# EAGLE design LCD (EAGLE 7.7.0)
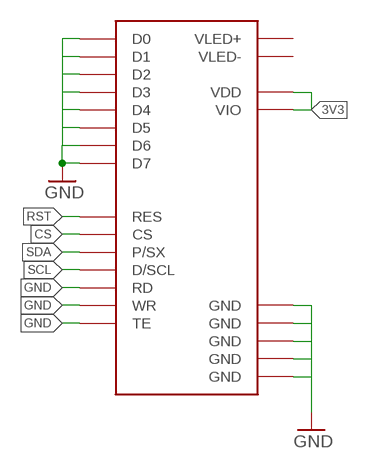
[diagram p0: schematic, sheet 1]

## Parts
U$1  NOKIA_LCD-CONN  [NOKIA3500]

## Nets
3V3: U$1.VDD U$1.VIO
CS: U$1.CS
GND: U$1.D0 U$1.D1 U$1.D2 U$1.D3 U$1.D4 U$1.D5 U$1.D6 U$1.D7 U$1.GND U$1.GND@1(GND) U$1.GND@3(GND) U$1.GND@4(GND) U$1.GND@5(GND) U$1.RD U$1.TE U$1.WR
RST: U$1.RES
SCL: U$1.D/CX_SCL(D/SCL)
SDA: U$1.P/S(P/SX)
Unconnected: U$1.VLED+ U$1.VLED-

## Library data of the parts
U$1 = nokia:NOKIA_LCD-CONN

## Board
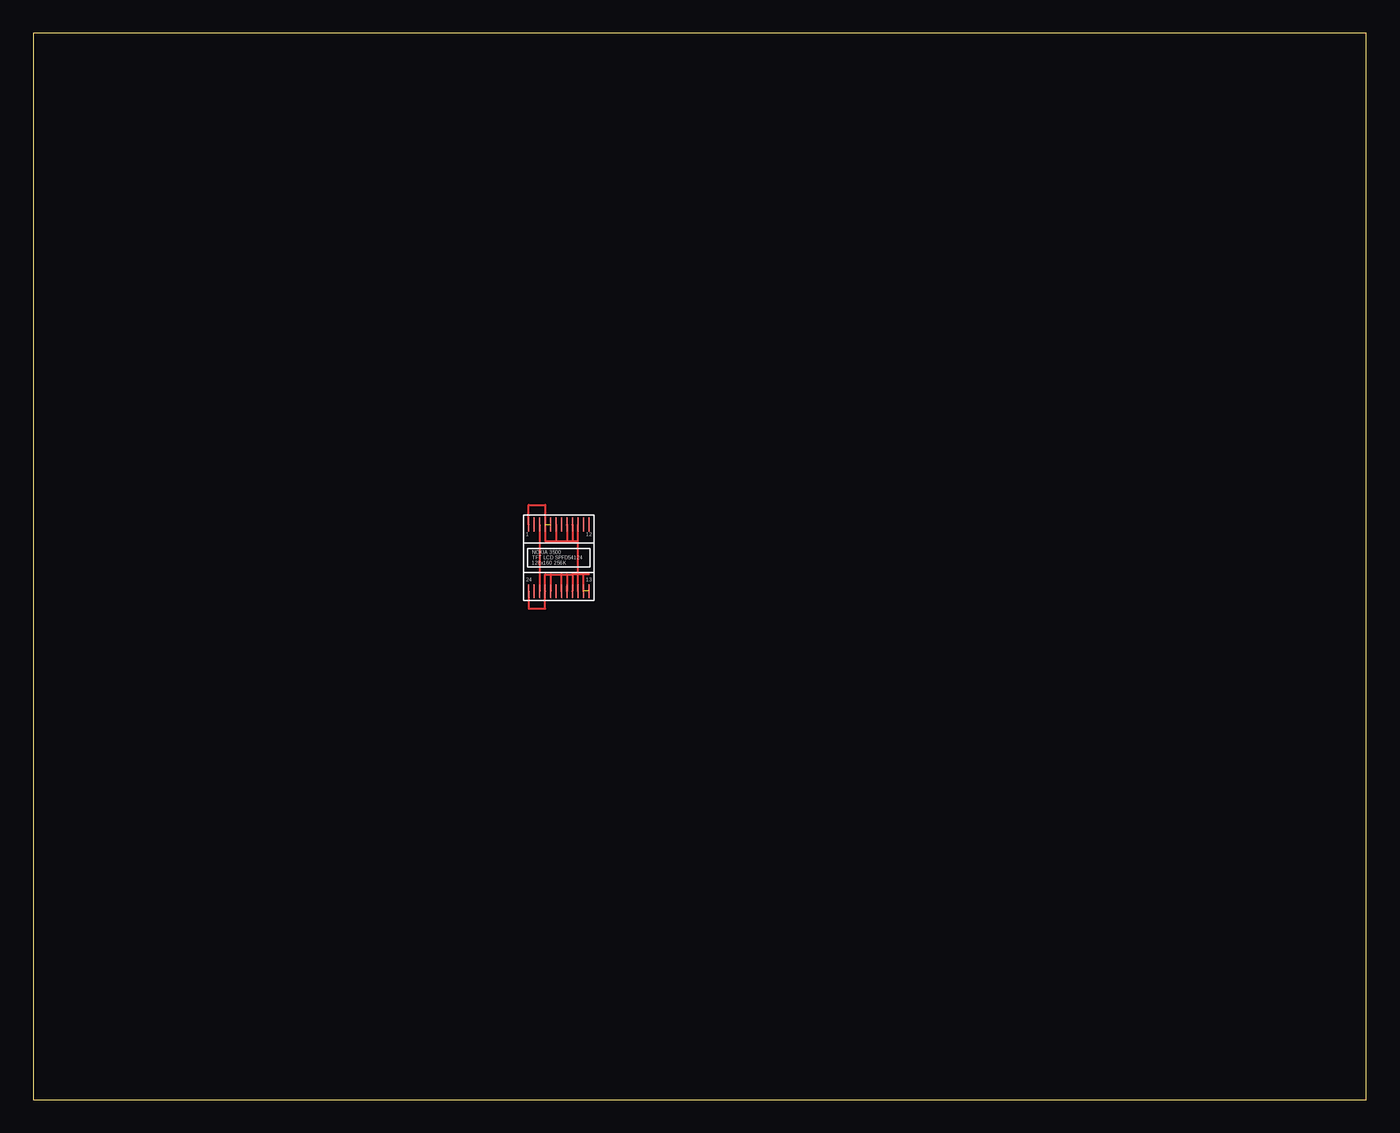
[diagram p1: board, top side]

Size 100 x 80 mm. Coordinates in mm from the lower left corner, seen from the top.
Outline: 0,0 100,0 100,80 0,80 0,0
Copper layers (1*16): Top 0.035mm / dielectric 1.5mm / Bottom 0.035mm
Design rules "default": minimum track width 10mil, minimum drill 24mil, track to track 8mil, track to pad 8mil, pad to pad 8mil, via to via 8mil, smd to smd 8mil, copper to edge 40mil, drill to drill 8mil, minimum pad ring 10mil, minimum via ring 8mil, stop-mask expansion 4mil, vias tented up to drill 0mil, thermal gap 10mil

### Footprints (pad centres in the part's own frame; a part is rotated, then mirrored left to right if it is on the bottom)
NOKIA3500 = smd 0.16 x 1.05: CS 1.9,2.5; D0 -0.15,2.5; D1 0.26,-2.5; D2 0.67,2.5; D3 0.67,-2.5; D4 1.08,2.5; D5 1.49,-2.5; D6 1.49,2.5; D7 1.9,-2.5; D/CX_SCL -0.15,-2.5; GND -2.2,2.5; GND@1 -0.97,2.5; GND@3 1.08,-2.5; GND@4 -0.97,-2.5; GND@5 -2.2,-2.5; P/S 0.26,2.5; RD -0.56,-2.5; RES 2.31,2.5; TE 2.31,-2.5; VDD -1.38,-2.5; VIO -1.38,2.5; VLED+ -1.79,-2.5; VLED- -1.79,2.5; WR -0.56,2.5

### Placement (x,y rotation side)
U$1  39.37,40.64 0 top

### Tracks (layer width: path | path; a pad name or v marks a point on that pad's centre or on a via)
3V3
  Top 0.16: U$1.VIO U$1.VDD
GND  (2 unrouted)
  Top 0.16: 40.86,39.4 40.86,41.9 | 40.86,41.9 U$1.D6 | 38.81,39.4 39.63,39.4 | 39.63,39.4 39.64,39.4 | 40.04,39.4 40.45,39.4 | 40.45,39.4 U$1.GND@3 | U$1.D0 39.22,41.9 | 39.22,41.9 40.04,41.9 | U$1.D2 40.04,41.9 | 40.04,41.9 40.45,41.9 | 39.63,39.4 39.63,39.38 | 40.04,38.53 U$1.D3 40.04,39.4 | U$1.D1 39.63,39.38 | 39.63,39.38 39.64,39.38 39.64,39.4 | 39.64,39.4 40.04,39.4 | 39.22,41.9 38.4,41.9 U$1.GND@1 38.4,44.61 37.17,44.61 U$1.GND | U$1.D7 41.27,39.4 | 41.27,39.4 40.86,39.4 | U$1.D5 40.86,39.4 | 40.86,39.4 40.45,39.4 | U$1.D4 40.45,41.9 | 40.45,41.9 40.86,41.9 | 41.68,39.4 41.27,39.4 | U$1.GND@5 37.16,36.83 38.4,36.83 U$1.GND@4 38.4,39.4 38.81,39.4 | 38.81,39.4 U$1.RD

### Text on the board
tPlace: NOKIA 3500 | 128x160 256K | TFT LCD SPFD54124